# Altium schematic sheet SignalReciever.SchDoc
size A2; ENG_APP_DATE: --/--/--; DSN_APP_DATE: --/--/--; CHK_APP_DATE: --/--/--; Date: 04.01.2021; Organization: Altium Limited; Address1: L3, 12a Rodborough Rd; Address2: Frenchs Forest; Address3: NSW; Address4: Australia 2086; SheetNumber: 2; SheetTotal: 2; Название устройства: Reciever; Version: 1
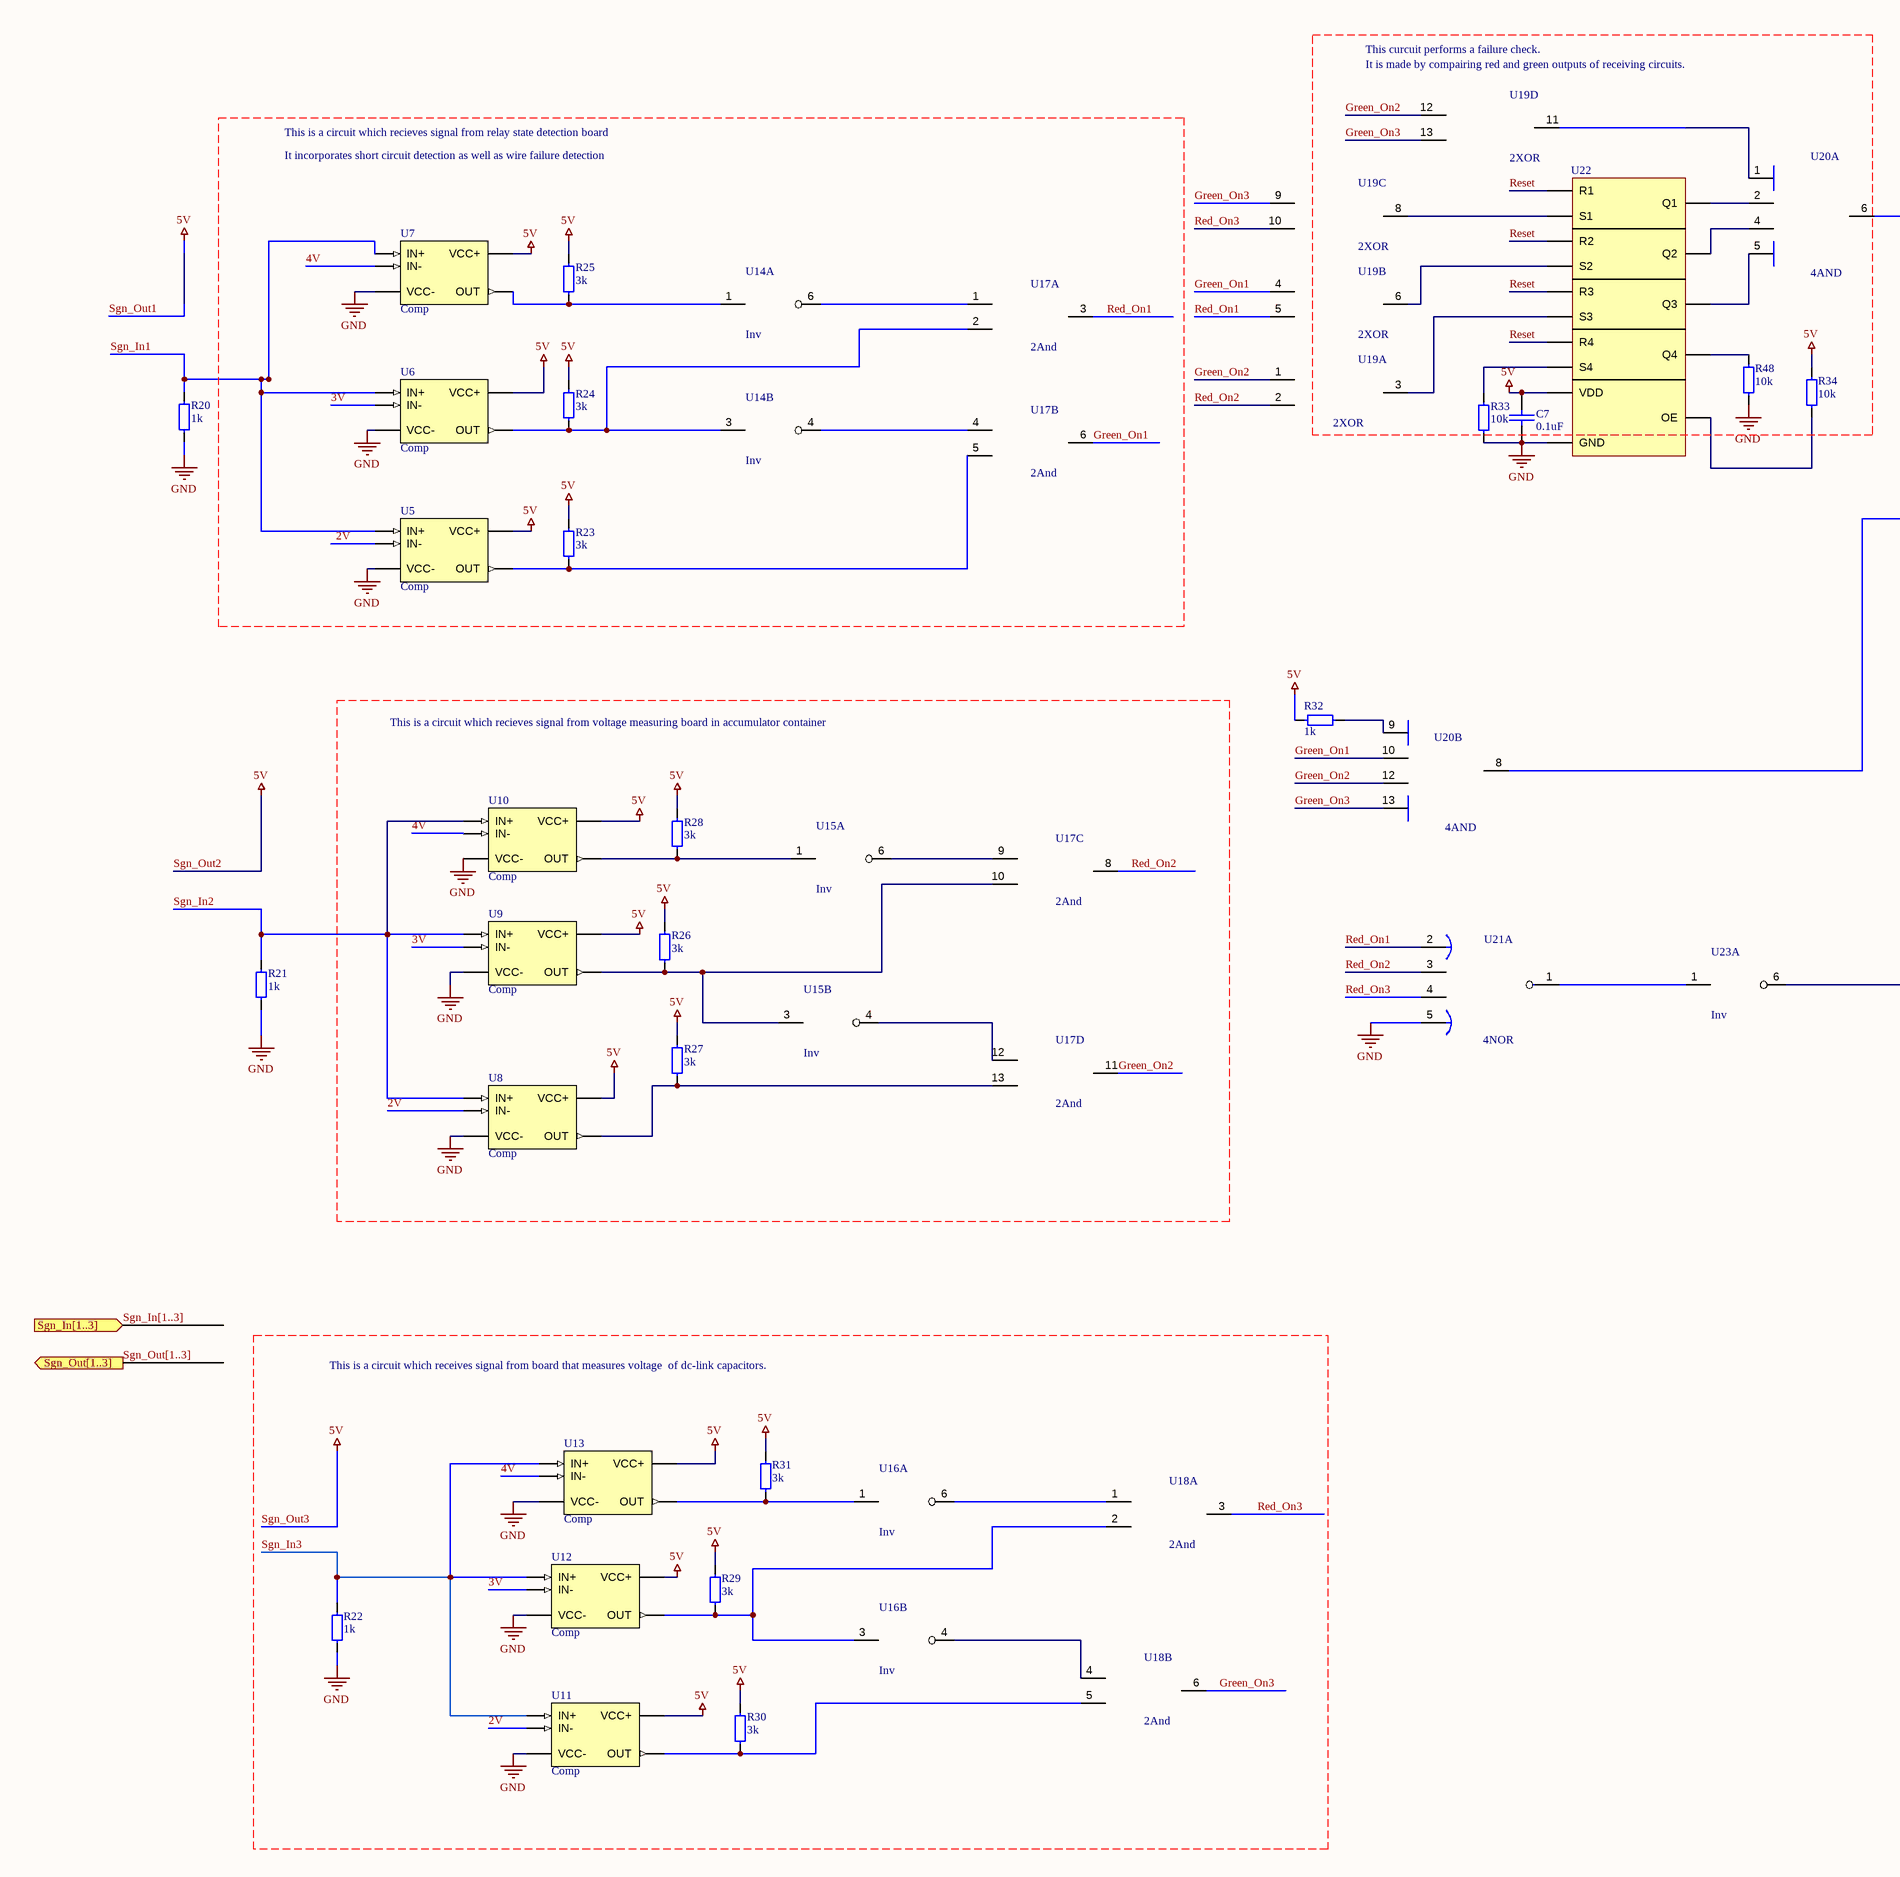
[diagram p0: SignalReciever.SchDoc, left]
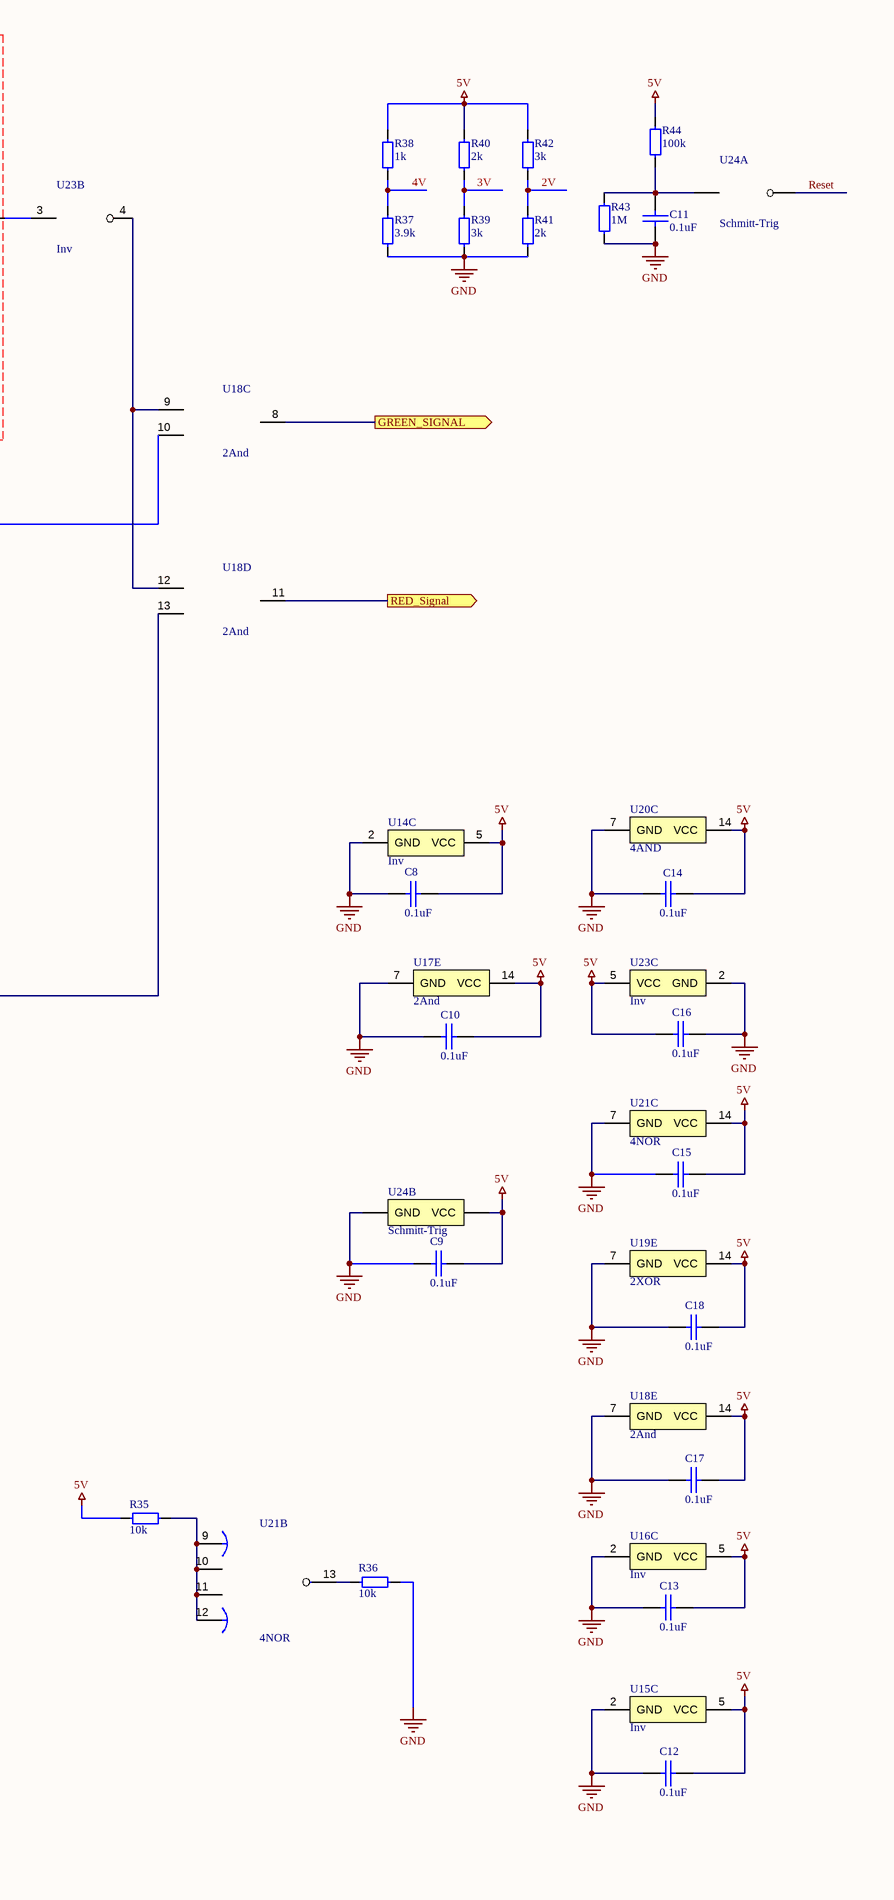
[diagram p1: SignalReciever.SchDoc, right]

## Parts
C7  0.1uF  [0603 Capicator]
C8  0.1uF  [0603 Capicator]
C9  0.1uF  [0603 Capicator]
C10  0.1uF  [0603 Capicator]
C11  0.1uF  [0603 Capicator]
C12  0.1uF  [0603 Capicator]
C13  0.1uF  [0603 Capicator]
C14  0.1uF  [0603 Capicator]
C15  0.1uF  [0603 Capicator]
C16  0.1uF  [0603 Capicator]
C17  0.1uF  [0603 Capicator]
C18  0.1uF  [0603 Capicator]
R20  1k  [0603 Resistor]
R21  1k  [0603 Resistor]
R22  1k  [0603 Resistor]
R23  3k  [0603 Resistor]
R24  3k  [0603 Resistor]
R25  3k  [0603 Resistor]
R26  3k  [0603 Resistor]
R27  3k  [0603 Resistor]
R28  3k  [0603 Resistor]
R29  3k  [0603 Resistor]
R30  3k  [0603 Resistor]
R31  3k  [0603 Resistor]
R32  1k  [0603 Resistor]
R33  10k  [0603 Resistor]
R34  10k  [0603 Resistor]
R35  10k  [0603 Resistor]
R36  10k  [0603 Resistor]
R37  3.9k  [0603 Resistor]
R38  1k  [0603 Resistor]
R39  3k  [0603 Resistor]
R40  2k  [0603 Resistor]
R41  2k  [0603 Resistor]
R42  3k  [0603 Resistor]
R43  1M  [0603 Resistor]
R44  100k  [0603 Resistor]
R48  10k  [0603 Resistor]
U5  Comp  [SOT-23-5]
U6  Comp  [SOT-23-5]
U7  Comp  [SOT-23-5]
U8  Comp  [SOT-23-5]
U9  Comp  [SOT-23-5]
U10  Comp  [SOT-23-5]
U11  Comp  [SOT-23-5]
U12  Comp  [SOT-23-5]
U13  Comp  [SOT-23-5]
U14  Inv  [SOT236]  (parts A,B,C of 3)
U15  Inv  [SOT236]  (parts A,B,C of 3)
U16  Inv  [SOT236]  (parts A,B,C of 3)
U17  2And  [SOIC-14]  (parts A,B,C,D,E of 5)
U18  2And  [SOIC-14]  (parts A,B,C,D,E of 5)
U19  2XOR  [SOIC-14]  (parts A,B,C,D,E of 5)
U20  4AND  [SOIC-14]  (parts A,B,C of 3)
U21  4NOR  [SOIC-14]  (parts A,B,C of 3)
U22  quad R/S latch with 3-state outputs  [SOIC-16]  (value not drawn)
U23  Inv  [SOT236]  (parts A,B,C of 3)
U24  Schmitt-Trig  [SOT-23-5]  (parts A,B of 2)

## Ports
GREEN_SIGNAL (out), RED_Signal (out), Sgn_In[1..3] (in), Sgn_Out[1..3] (out)

## Nets
GND: C7.1 C8.1 C9.1 C10.1 C11.1 C12.1 C13.1 C14.1 C15.1 C16.2 C17.1 C18.1 R20.1 R21.1 R22.1 R33.2 R36.2 R37.1 R39.1 R41.1 R43.1 R48.2 U5.2(VCC-) U6.2(VCC-) U7.2(VCC-) U8.2(VCC-) U9.2(VCC-) U10.2(VCC-) U11.2(VCC-) U12.2(VCC-) U13.2(VCC-) U14.2(GND) U15.2(GND) U16.2(GND) U17.7(GND) U18.7(GND) U19.7(GND) U20.7(GND) U21.5(D) U21.7(GND) U22.16(GND) U23.2(GND) U24.3(GND)
Sgn_Out1: C7.2 C8.2 C9.2 C10.2 C12.2 C13.2 C14.2 C15.2 C16.1 C17.2 C18.2 R23.2 R24.2 R25.2 R26.2 R27.2 R28.2 R29.2 R30.2 R31.2 R32.2 R34.1 R35.1 R38.1 R40.2 R42.2 R44.2 U5.5(VCC+) U6.5(VCC+) U7.5(VCC+) U8.5(VCC+) U9.5(VCC+) U10.5(VCC+) U11.5(VCC+) U12.5(VCC+) U13.5(VCC+) U14.5(VCC) U15.5(VCC) U16.5(VCC) U17.14(VCC) U18.14(VCC) U19.14(VCC) U20.14(VCC) U21.14(VCC) U22.8(VDD) U23.5(VCC) U24.5(VCC)  [also labelled 5V, Sgn_Out2, Sgn_Out3]
2V: R41.2 R42.1 U5.3(IN-) U8.3(IN-) U11.3(IN-)
3V: R39.2 R40.1 U6.3(IN-) U9.3(IN-) U12.3(IN-)
4V: R37.2 R38.2 U7.3(IN-) U10.3(IN-) U13.3(IN-)
Green_On1: U17.6(2Y) U19.4(A) U20.10(B)
Green_On2: U17.11(4Y) U19.1(A) U19.12(A) U20.12(C)
Green_On3: U18.6(2Y) U19.9(A) U19.13(B) U20.13(D)
GREEN_SIGNAL: U18.8(3Y) ; port GREEN_SIGNAL
Red_On1: U17.3(1Y) U19.5(B) U21.2(A)
Red_On2: U17.8(3Y) U19.2(B) U21.3(B)
Red_On3: U18.3(1Y) U19.10(B) U21.4(C)
RED_Signal: U18.11(4Y) ; port RED_Signal
Reset: U22.3(R1) U22.7(R2) U22.11(R3) U22.15(R4) U24.4(Y)
Sgn_In1: R20.2 U5.1(IN+) U6.1(IN+) U7.1(IN+)
Sgn_In2: R21.2 U8.1(IN+) U9.1(IN+) U10.1(IN+)
Sgn_In3: R22.2 U11.1(IN+) U12.1(IN+) U13.1(IN+)
NetC11_2: C11.2 R43.2 R44.1 U24.2(in)
NetR23_1: R23.1 U5.4(OUT) U17.5(2B)
NetR24_1: R24.1 U6.4(OUT) U14.3(2А) U17.2(1B)
NetR25_1: R25.1 U7.4(OUT) U14.1(1A)
NetR26_1: R26.1 U9.4(OUT) U15.3(2А) U17.10(3B)
NetR27_1: R27.1 U8.4(OUT) U17.13(4B)
NetR28_1: R28.1 U10.4(OUT) U15.1(1A)
NetR29_1: R29.1 U12.4(OUT) U16.3(2А) U18.2(1B)
NetR30_1: R30.1 U11.4(OUT) U18.5(2B)
NetR31_1: R31.1 U13.4(OUT) U16.1(1A)
NetR32_1: R32.1 U20.9(A)
NetR33_1: R33.1 U22.14(S4)
NetR34_2: R34.2 U22.5(OE)
NetR35_2: R35.2 U21.9(A) U21.10(B) U21.11(C) U21.12(D)
NetR36_1: R36.1 U21.13(Y)
NetR48_1: R48.1 U22.1(Q4)
NetU14_4: U14.4(2Y) U17.4(2A)
NetU14_6: U14.6(1Y) U17.1(1A)
NetU15_4: U15.4(2Y) U17.12(4A)
NetU15_6: U15.6(1Y) U17.9(3A)
NetU16_4: U16.4(2Y) U18.4(2A)
NetU16_6: U16.6(1Y) U18.1(1A)
NetU18_9: U18.9(3A) U18.12(4A) U23.4(2Y)
NetU18_10: U18.10(3B) U20.8(Y)
NetU18_13: U18.13(4B) U23.6(1Y)
NetU19_3: U19.3(Y) U22.12(S3)
NetU19_6: U19.6(Y) U22.6(S2)
NetU19_8: U19.8(Y) U22.4(S1)
NetU19_11: U19.11(Y) U20.1(A)
NetU20_2: U20.2(B) U22.2(Q1)
NetU20_4: U20.4(C) U22.9(Q2)
NetU20_5: U20.5(D) U22.10(Q3)
NetU20_6: U20.6(Y) U23.3(2А)
NetU21_1: U21.1(Y) U23.1(1A)

## Buses and harness runs
bus Sgn_In[1..3] = port Sgn_In[1..3]
bus Sgn_Out[1..3] = port Sgn_Out[1..3]

## Notes on the sheet
- This curcuit performs a failure check.
- (near U19) It is made by compairing red and green outputs of receiving circuits.
- This is a circuit which recieves signal from relay state detection board
- It incorporates short circuit detection as well as wire failure detection
- This is a circuit which recieves signal from voltage measuring board in accumulator container
- This is a circuit which receives signal from board that measures voltage  of dc-link capacitors.
- Univercity:
- Size:
- Date:
- Document Version:
- A3
- Car#:
- Time:
- 418
- Team:
- Sheet
- BRT
- of
- Technical University
- Bauman Moscow State

## Library data of the parts
C7-C18 = Cap 0.1uF (0603): 0.1uF X7R 16V 10% 0603; Manufacturer: Murata Manufacturing; Part Number: GRM188R71C104KA01D; Type: Capacitor; ComponentLink1Description: Chip&Dip; ComponentLink1URL: https://www.chipdip.ru/product/grm188r71c104ka01d
R20-R22 R32 R38 = Res 1k (0603): 0.1W 0603 1k, 1%; Part Number: RC0603FR-071KL; Manufacturer: Taiwan; Type: Resistor; ComponentLink1Description: Chip&Dip; ComponentLink1URL: https://www.chipdip.ru/product0/9000079676
R23-R31 R39 R42 = Res 3k (0603): 0.1W 0603 3k, 1%; Part Number: RC0603FR-073KL; Manufacturer: Taiwan; Type: Resistor; ComponentLink1Description: Chip&Dip; ComponentLink1URL: https://www.chipdip.ru/product0/9000079723
R33-R36 R48 = Res 10k (0603): 0.1W 0603 10k, 1%; Part Number: RC0603FR-0710KL; Manufacturer: Taiwan; Type: Resistor; ComponentLink1Description: Chip&Dip; ComponentLink1URL: https://www.chipdip.ru/product0/9000079736
R37 = Res 3.9k (0603): 0.1W 0603 3.9k, 1%; Part Number: RC0603FR-073K9L; Manufacturer: Taiwan; Type: Resistor; ComponentLink1Description: Chip&Dip; ComponentLink1URL: https://www.chipdip.ru/product0/9000079726
R40 R41 = Res 2k (0603): 0.1W 0603 2k, 1%; Part Number: RC0603FR-072KL; Manufacturer: Taiwan; Type: Resistor; ComponentLink1Description: Chip&Dip; ComponentLink1URL: https://www.chipdip.ru/product0/9000079719
R43 = Res 1M (0603): 0.1W 0603 1M, 1%; Part Number: RC0603FR-071ML; Manufacturer: Taiwan; Type: Resistor; ComponentLink1Description: Chip&Dip; ComponentLink1URL: https://www.chipdip.ru/product0/9000079784
R44 = Res 100k (0603): 0.1W 0603 100k, 1%; Part Number: RC0603FR-07100KL; Manufacturer: Taiwan; Type: Resistor; ComponentLink1Description: Chip&Dip; ComponentLink1URL: https://www.chipdip.ru/product0/9000079760
U5-U13 = Comparator [LMV]: Differential comparator with strobes; Part Number: LMV331M5/NOPB; Manufacturer: Texas Instruments; ComponentLink1Description: DataSheet; ComponentLink1URL: https://static.chipdip.ru/lib/291/DOC000291302.pdf; ComponentLink2Description: Chip&Dip; ComponentLink2URL: https://www.chipdip.ru/product/lmv331m5-nopb; Type: IC
U14-U16 U23 = Inverter (SN74): Dual inverter, 1.65-5.5V; Manufacturer: Texas Instruments; Part Number: SN74LVC2G04DBVR; ComponentLink1Description: Chip&Dip; ComponentLink1URL: https://www.chipdip.ru/product/sn74lvc2g04dbvr-2; ComponentLink2Description: DataSheet; ComponentLink2URL: https://static.chipdip.ru/lib/021/DOC001021810.pdf; Type: IC
U17 U18 = 4(2And): 4 logic elements "2AND"; Part Number: SN74AC08DR; Manufacturer: Texas Instruments; ComponentLink1Description: DataSheet; ComponentLink1URL: https://static.chipdip.ru/lib/551/DOC001551527.pdf; ComponentLink2Description: Chip&Dip; ComponentLink2URL: https://www.chipdip.ru/product/sn74ac08dr; Type: IC
U19 = 4(2XOR): 4 logic elements "2XOR"; Part Number: 74HC86D,653; Manufacturer: Nexperia; ComponentLink1Description: Chip&Dip; ComponentLink1URL: https://www.chipdip.ru/product/74hc86d; Type: IC; ComponentLink2Description: DataSheet; ComponentLink2URL: https://ru.mouser.com/datasheet/2/916/74HC_HCT86-1319799.pdf
U20 = 2(4AND): 2 logic elements "4AND"; Part Number: 74HC21D,653; Manufacturer: Nexperia; ComponentLink1Description: Chip&Dip; ComponentLink1URL: https://www.chipdip.ru/product/74hc21d.653; Type: IC; ComponentLink2Description: DataSheet; ComponentLink2URL: https://static.chipdip.ru/lib/522/DOC011522559.pdf
U21 = 2(4NOR): 2 logic elements "4NOR"; Part Number: 74HC4002D,652; Manufacturer: Nexperia; ComponentLink1Description: Chip&Dip; ComponentLink1URL: https://www.chipdip.ru/product/74hc4002d; Type: IC; ComponentLink2Description: DataSheet; ComponentLink2URL: https://static.chipdip.ru/lib/493/DOC011493188.pdf
U22 = 4 RS triggers: The HEF4043B is a quad R/S latch with 3-state outputs and common output enable input (OE).; ComponentLink1Description: Datasheet; ComponentLink1URL: https://static.chipdip.ru/lib/486/DOC014486419.pdf; ComponentLink2Description: CHIPDIP; ComponentLink2URL: https://www.chipdip.ru/product/hef4043bt-652-nexperia
U24 = Schmitt Trigger [NC7SZ]: The NC7SZ14M5X is a single Inverter with Schmitt-trigger input from ultra-high speed (UHS) series of TinyLogic®. The device is fabricated with advanced CMOS technology to achieve ultra-high speed with high output drive while maintaining low static power dissipation over a very broad VCC operating range. The device is specified to operate over the 1.65 to 5.5V VCC range. The inputs and outputs are high-impedance when VCC is 0V. Inputs tolerate voltages up to 6V independent of VCC operating voltage.; Manufacturer: ON Semiconductor; Part Number: NC7SZ14M5X; ComponentLink1Description: DataSheet; ComponentLink1URL: https://static.chipdip.ru/lib/321/DOC000321280.pdf; ComponentLink2Description: Chip&Dip; ComponentLink2URL: https://www.chipdip.ru/product/nc7sz14m5x; Type: IC